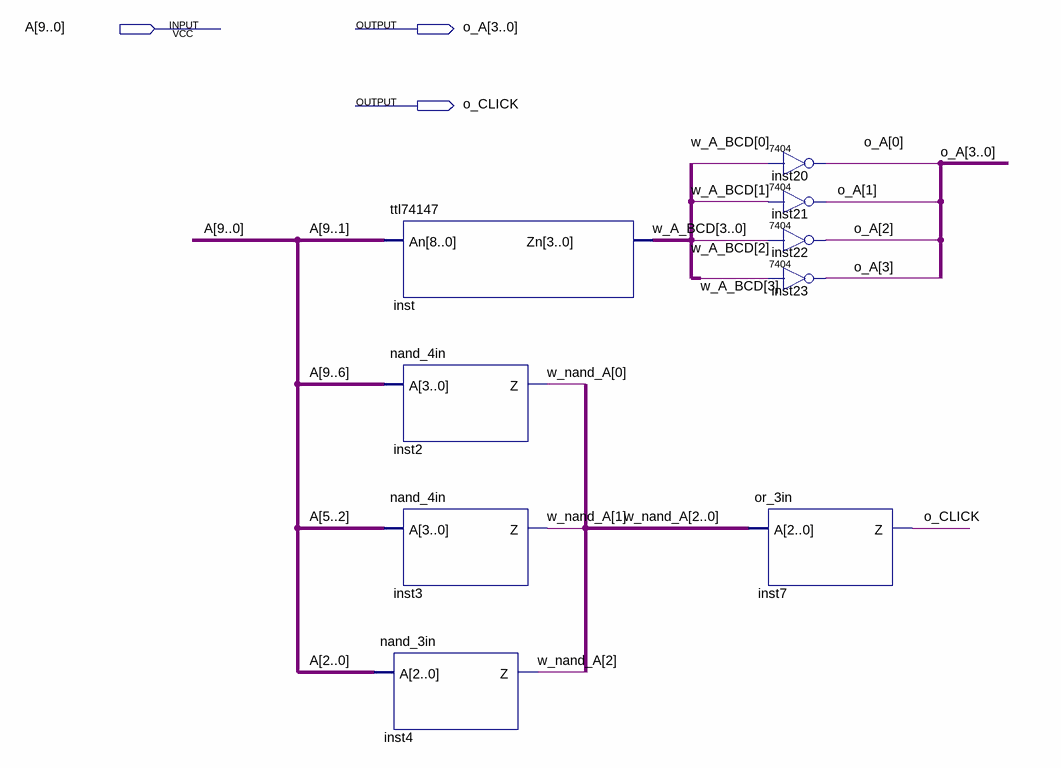
[diagram p0: schematic sheet]
// Quartus schematic input_part.bdf as structural Verilog: 9 symbols, 3 pins
module input_part (
  input  [9:0] A,
  output [3:0] o_A,
  output o_CLICK
);

  wire [2:0] w_nand_A;
  wire [3:0] w_A_BCD;

  ttl74147 inst (.An(A[9:1]), .Zn(w_A_BCD));
  nand_4in inst2 (.A(A[9:6]), .Z(w_nand_A[0]));
  nand_4in inst3 (.A(A[5:2]), .Z(w_nand_A[1]));
  nand_3in inst4 (.A(A[2:0]), .Z(w_nand_A[2]));
  \7404  inst20 (.\2 (w_A_BCD[0]), .\1 (o_A[0]));
  \7404  inst21 (.\2 (w_A_BCD[1]), .\1 (o_A[1]));
  \7404  inst22 (.\2 (w_A_BCD[2]), .\1 (o_A[2]));
  \7404  inst23 (.\2 (w_A_BCD[3]), .\1 (o_A[3]));
  or_3in inst7 (.A(w_nand_A), .Z(o_CLICK));
endmodule
